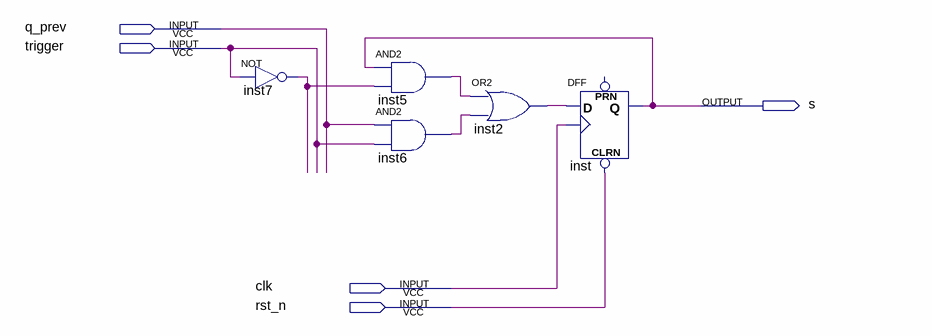
[diagram p0: schematic sheet]
// Quartus schematic s3456.bdf as structural Verilog: 5 symbols, 5 pins
module s3456 (
  input  q_prev,
  input  trigger,
  input  clk,
  input  rst_n,
  output s
);

  wire inst2_out, inst5_out, inst6_out, inst7_out;

  not inst7 (inst7_out, trigger);
  and inst5 (inst5_out, s, inst7_out);
  and inst6 (inst6_out, q_prev, trigger);
  or inst2 (inst2_out, inst5_out, inst6_out);
  DFF inst (.CLRN(rst_n), .CLK(clk), .D(inst2_out), .Q(s));  // open: PRN
endmodule
